# EAGLE schematic atom-hub-proto-self-template-board-outline (EAGLE 7.7.0)
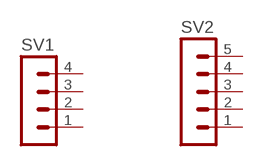
[diagram p0: schematic, sheet 1]

## Parts
SV1  MA04-1  [MA04-1]
SV2  MA05-1  [MA05-1]
Unconnected: SV1.1 SV1.2 SV1.3 SV1.4 SV2.1 SV2.2 SV2.3 SV2.4 SV2.5

## Library data of the parts
SV1 = con-lstb:MA04-1: PIN HEADER; OC_FARNELL: unknown; OC_NEWARK: unknown
SV2 = con-lstb:MA05-1: PIN HEADER; OC_FARNELL: unknown; OC_NEWARK: unknown

## Net classes
0 default: width 0.15 mm, drill 0.3 mm, clearance 0.15 mm